# EAGLE design output (EAGLE 9.6.2)
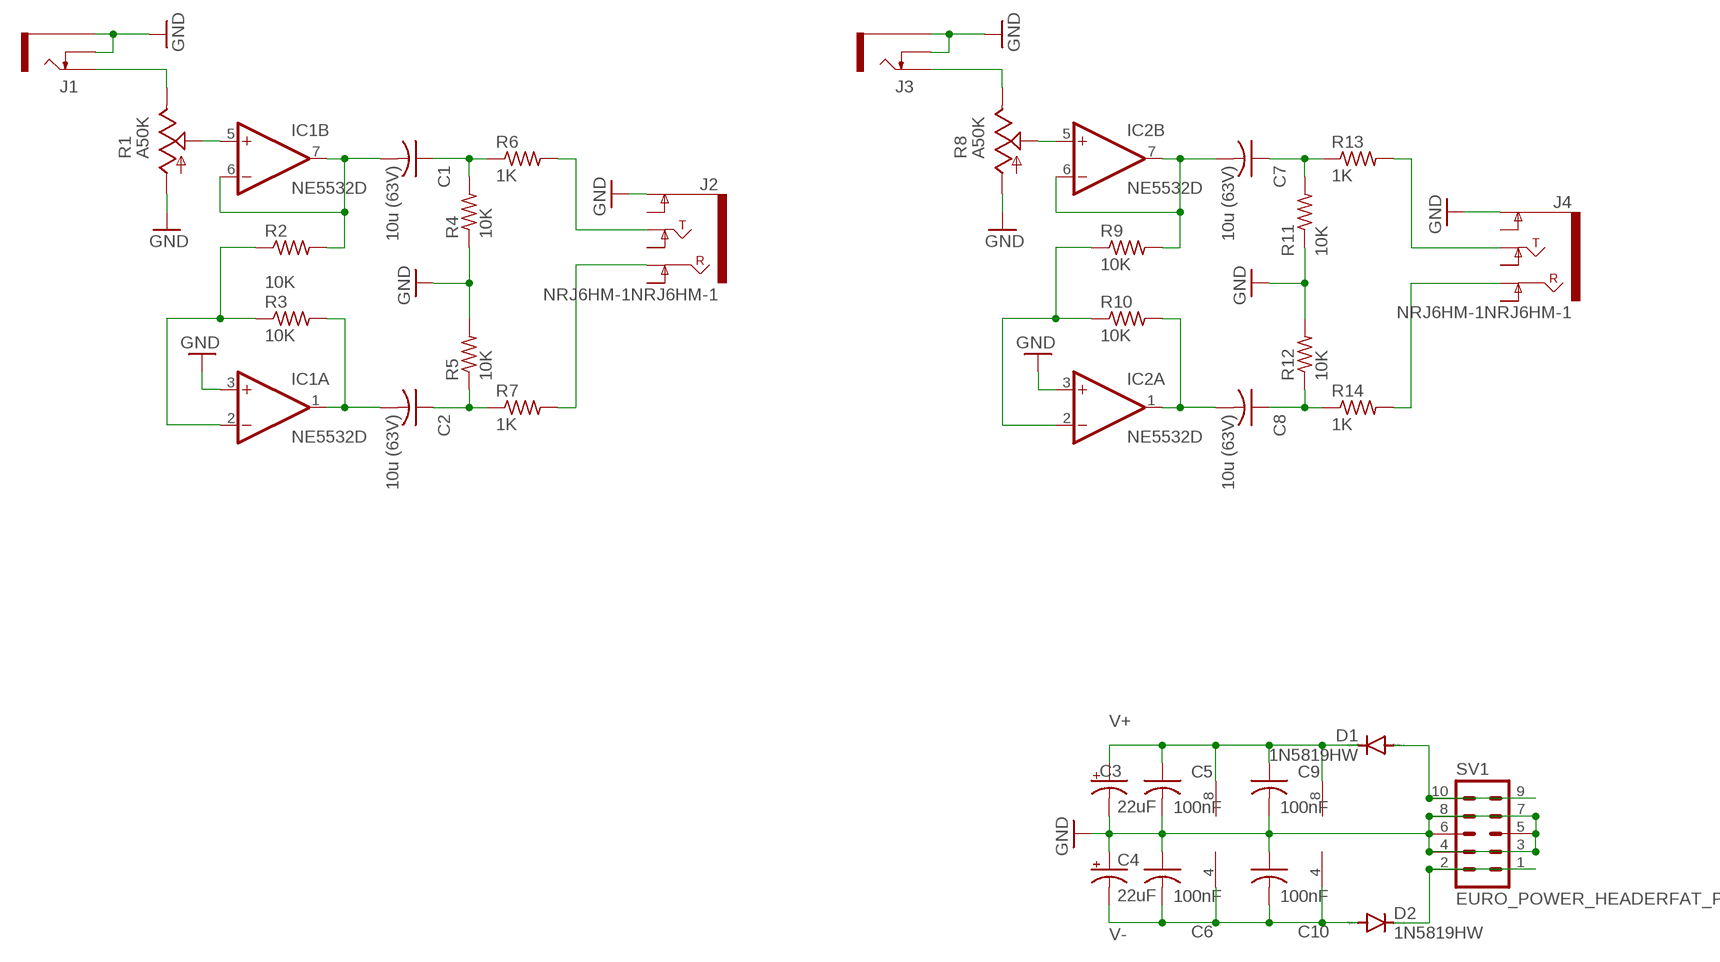
[diagram p0: schematic, sheet 1]

## Parts
C1  10u (63V)  C-USC1210  [C1210]
C2  10u (63V)  C-USC1210  [C1210]
C3  22uF  CPOL-USB  [PANASONIC_B]
C4  22uF  CPOL-USB  [PANASONIC_B]
C5  100nF  C-USC0805  [C0805]
C6  100nF  C-USC0805  [C0805]
C7  10u (63V)  C-USC1210  [C1210]
C8  10u (63V)  C-USC1210  [C1210]
C9  100nF  C-USC0805  [C0805]
C10  100nF  C-USC0805  [C0805]
D1  1N5819HW  DIODE-SOD123  [SOD123]
D2  1N5819HW  DIODE-SOD123  [SOD123]
IC1  NE5532D  [SO08]
IC2  NE5532D  [SO08]
J1  PJ302M  [PJ302M]
J2  NRJ6HM-1NRJ6HM-1  [NRJ6HM-1]
J3  PJ302M  [PJ302M]
J4  NRJ6HM-1NRJ6HM-1  [NRJ6HM-1]
R1  A50K  ALPHA_9MM_POT_RIGHT_ANGLE  [ALPHA_9MM_POT_RIGHT_ANGLE]
R2  10K  R-US_R0805  [R0805]
R3  10K  R-US_R0805  [R0805]
R4  10K  R-US_R0805  [R0805]
R5  10K  R-US_R0805  [R0805]
R6  1K  R-US_R0805  [R0805]
R7  1K  R-US_R0805  [R0805]
R8  A50K  ALPHA_9MM_POT_RIGHT_ANGLE  [ALPHA_9MM_POT_RIGHT_ANGLE]
R9  10K  R-US_R0805  [R0805]
R10  10K  R-US_R0805  [R0805]
R11  10K  R-US_R0805  [R0805]
R12  10K  R-US_R0805  [R0805]
R13  1K  R-US_R0805  [R0805]
R14  1K  R-US_R0805  [R0805]
SV1  EURO_POWER_HEADERFAT_PADS  [EURO_PWR_HEADER_FAT]

## Nets
GND: C3.- C4.+ C5.2 C6.1 C9.2 C10.1 IC1.3(A:+IN) IC2.3(A:+IN) J1.GND(SLEEVE) J1.SW(SWITCH) J2.SLEEVE(EARTH) J3.GND(SLEEVE) J3.SW(SWITCH) J4.SLEEVE(EARTH) R1.1(A) R4.1 R5.2 R8.1(A) R11.1 R12.2 SV1.3 SV1.4 SV1.5 SV1.6 SV1.7 SV1.8
N$1: IC1.2(A:-IN) R2.1 R3.1
N$2: C2.2 IC1.1(A:OUT) R3.2
N$3: C1.2 IC1.6(B:-IN) IC1.7(B:OUT) R2.2
N$4: IC1.5(B:+IN) R1.2(S)
N$5: C1.1 R4.2 R6.1
N$6: IC2.5(B:+IN) R8.2(S)
N$7: C2.1 R5.1 R7.1
N$9: J1.TIP R1.3(E)
N$10: J2.TIP R6.2
N$12: J3.TIP R8.3(E)
N$14: J2.RING R7.2
N$15: D1.A SV1.9 SV1.10
N$17: C7.1 R11.2 R13.1
N$19: C8.1 R12.1 R14.1
N$20: J4.TIP R13.2
N$21: J4.RING R14.2
N$22: IC2.2(A:-IN) R9.1 R10.1
N$23: C8.2 IC2.1(A:OUT) R10.2
N$24: C7.2 IC2.6(B:-IN) IC2.7(B:OUT) R9.2
N$25: D2.C SV1.1 SV1.2
V+: C3.+ C5.1 C9.1 D1.C IC1.8(P:V+) IC2.8(P:V+)
V-: C4.- C6.2 C10.2 D2.A IC1.4(P:V-) IC2.4(P:V-)
Unconnected: J2.RING-NORM J2.SLEEVE-NORM(EARTH-NORM) J2.TIP-NORM J4.RING-NORM J4.SLEEVE-NORM(EARTH-NORM) J4.TIP-NORM

## Library data of the parts
C1 C2 C5-C10 = rcl:C-US: CAPACITOR, American symbol; SPICEPREFIX: C
C3 C4 = rcl:CPOL-US: POLARIZED CAPACITOR, American symbol; SPICEPREFIX: C
D1 D2 = diode:DIODE-: DIODE
IC1 IC2 = linear:NE5532: AUDIO AMPLIFIER
J1 J3 = eurorack:PJ302M: PJ302M horizontal / right angled mount 3.5 mm jack socket
J2 J4 = eurorack:NRJ6HM-1: Neutrik NRJ6HM-1 See: Neutrik NRJ6HM-1 datasheet <https://www.neutrik.com/en/product/nrj6hm-1>
R1 R8 = eurorack:ALPHA_9MM_POT_RIGHT_ANGLE: Alpha 9mm right angle / horizontal potentiometer See: Thonk Alpha 9mm Pots – Right-Angle T18 Shaft <https://www.thonk.co.uk/shop/alpha-right-angle-t18/>
R2-R7 R9-R14 = rcl:R-US_: RESISTOR, American symbol; SPICEPREFIX: R
SV1 = MusicThingModular:EURO_POWER_HEADER: Power Header 10 pin power header for Eurorack Power Supplies Variants with fatter pads for easier soldering, and the LOCK variant which has 5mil offset pins to hold the component in place before soldering

## Board
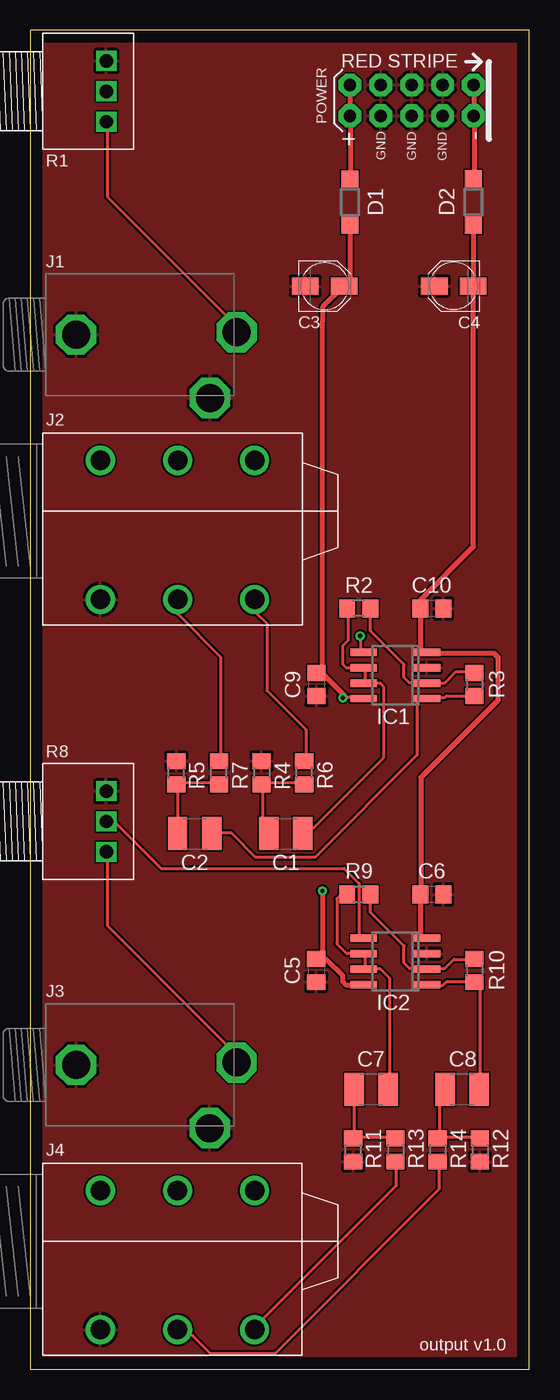
[diagram p1: board, top side]
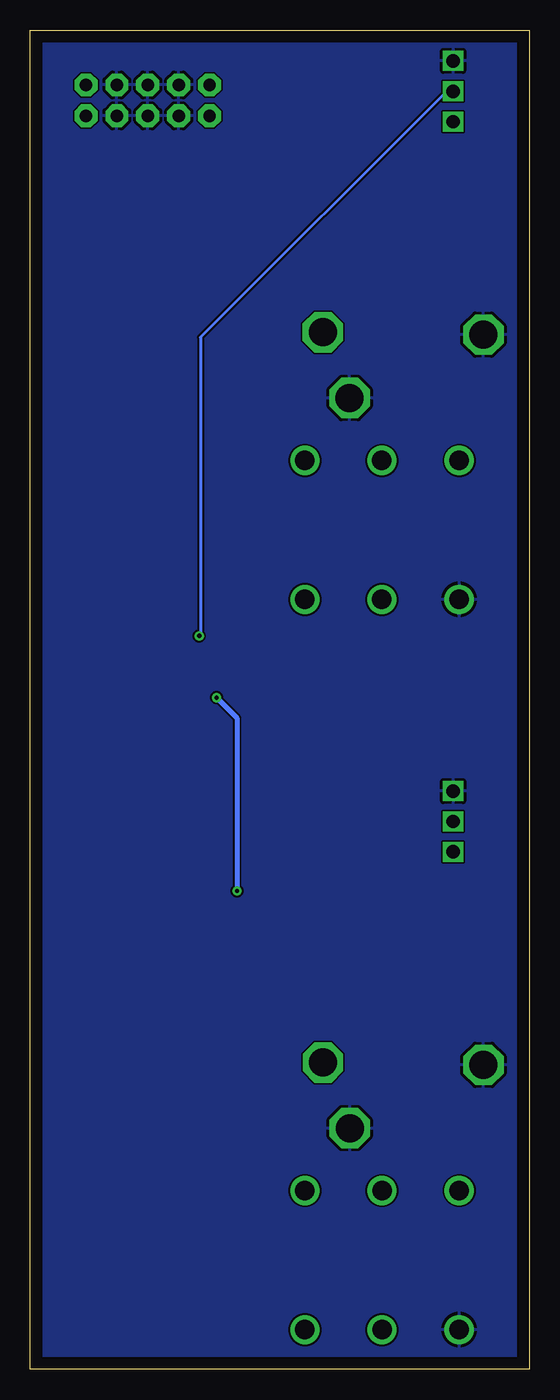
[diagram p2: board, bottom side, seen from below]

Size 41 x 110 mm. Coordinates in mm from the lower left corner, seen from the top.
Outline: 0,0 41,0 41,110 0,110 0,0
Copper layers (1*16): Top 0.035mm / dielectric 1.5mm / Bottom 0.035mm
Design rules "default": minimum track width 6mil, minimum drill 0.35mm, track to track 6mil, track to pad 6mil, pad to pad 6mil, via to via 6mil, smd to smd 6mil, copper to edge 40mil, drill to drill 6mil, minimum pad ring 10mil, minimum via ring 8mil, stop-mask expansion 4mil, vias tented up to drill 0mil, thermal gap 10mil

### Footprints (pad centres in the part's own frame; a part is rotated, then mirrored left to right if it is on the bottom)
C1210 = smd 1.6 x 2.7: 1 -1.4,0; 2 1.4,0
PANASONIC_B = smd 2.2 x 1.4: + 1.6,0; - -1.6,0
C0805 = smd 1.3 x 1.5: 1 -0.95,0; 2 0.95,0
SOD123 = smd 1.4 x 1.4: A 1.9,0; C -1.9,0
SO08 = smd 0.6 x 2.2: 1 -1.905,-2.6; 2 -0.635,-2.6; 3 0.635,-2.6; 4 1.905,-2.6; 5 1.905,2.6; 6 0.635,2.6; 7 -0.635,2.6; 8 -1.905,2.6
PJ302M = drill 2.3 pad 3.3 octagon: GND 2.5,0; SW 13.5,-5.2; TIP 15.7,0.2
NRJ6HM-1 = drill 1.6: RING 11.1,-7.26; RING-NORM 11.1,4.17; SLEEVE 4.75,-7.26; SLEEVE-NORM 4.75,4.17; TIP 17.43,-7.26; TIP-NORM 17.43,4.17
ALPHA_9MM_POT_RIGHT_ANGLE = drill 1.1 square: 1 -2.5,0; 2 0,0; 3 2.5,0
R0805 = smd 1.3 x 1.5: 1 -0.95,0; 2 0.95,0
EURO_PWR_HEADER_FAT = drill 1.016 pad 1.88 octagon: 1 -5.08,-1.27; 2 -5.08,1.27; 3 -2.54,-1.27; 4 -2.54,1.27; 5 0,-1.27; 6 0,1.27; 7 2.54,-1.27; 8 2.54,1.27; 9 5.08,-1.27; 10 5.08,1.27

### Placement (x,y rotation side)
C1  21,44 0 top
C2  13.5,44 0 top
C3  24.2,89 0 top
C4  34.8,89 180 top
C5  23.5,32.75 270 top
C6  33,39 180 top
C7  28,23 0 top
C8  35.48,23 0 top
C9  23.52,56.25 270 top
C10  33,62.5 180 top
D1  26.27,95.89 90 top
D2  36.42,95.9 270 top
IC1  30,57 90 top
IC2  30,33.5 90 top
J1  1.25,85 0 top
J2  1,70.5 0 top
J3  1.25,25 0 top
J4  1,10.5 0 top
R1  6.25,105 270 top
R2  27,62.5 180 top
R3  36.5,56.25 270 top
R4  19.01,49 270 top
R5  12.01,49 90 top
R6  22.51,49 90 top
R7  15.51,49 90 top
R8  6.25,45 270 top
R9  27,39 180 top
R10  36.5,32.75 270 top
R11  26.54,18 90 top
R12  36.95,18 270 top
R13  30.01,18 270 top
R14  33.48,18 270 top
SV1  31.35,104.25 180 top

### Tracks (layer width: path | path; a pad name or v marks a point on that pad's centre or on a via)
GND
  pour Top: 41.76,110.6 0,110.6 -0.04,110.56 -0.04,-1.27 41.76,-1.27
  pour Bottom: 41.45,110.33 0.43,110.33 0.43,-0.7 41.45,-0.7
N$1
  Top 0.254: R2.1 27.98,62.48 27.98,60.66 30.72,57.91 30.72,56.84 31.18,56.39 32.55,56.39 IC1.2 32.7,56.39 34.07,56.39 34.98,57.3 36.36,57.3 R3.1
N$2
  Top 0.254: R3.2 36.36,55.32 34.22,55.32 34.07,55.17 32.7,55.17 IC1.1 32.55,55.02 31.94,55.02 31.79,54.86 31.79,50.44 23.4,42.06 18.53,42.06 16.55,44.04 15.02,44.04 C2.2
N$3
  Top 0.254: R2.2 26.15,62.48 26.15,59.89 25.69,59.44 25.69,57.91 25.99,57.61 27.36,57.61 IC1.6 27.52,57.61 27.52,56.39 | C1.2 22.82,44 29.04,50.23 29.04,56.08 28.74,56.39 27.52,56.39 | 27.52,56.39 IC1.7
N$4  (via drill 0.35)
  Top 0.254: IC1.5 27.12,59.19 v27.12,60.25
  Bottom 0.254: v27.12,60.25 27.02,60.35 27.02,84.78 6.94,104.85 6.33,104.85 R1.2
N$5
  Top 0.254: R6.1 22.49,48.16 19.14,48.16 R4.2 19.14,48.01 19.14,44.5 19.59,44.04 C1.1
N$6
  Top 0.254: IC2.5 27.02,35.79 27.02,37.89 27.01,37.9 27.01,39.93 25.78,41.16 10.74,41.16 6.94,44.96 6.33,44.96 R8.2
N$7
  Top 0.254: R7.1 15.48,48.16 12.12,48.16 R5.1 12.12,48.01 12.12,44.04 C2.1
N$9
  Top 0.254: R1.3 6.33,102.41 6.33,96.32 16.85,85.8 16.85,85.34 J1.TIP
N$10
  Top 0.254: R6.2 22.64,49.99 22.64,52.55 19.44,55.75 19.44,61.27 18.53,62.18 18.53,63.14 J2.TIP
N$12
  Top 0.254: R8.3 6.33,42.37 6.33,36.42 16.85,25.91 16.85,25.3 J3.TIP
N$14
  Top 0.254: R7.2 15.63,49.99 15.63,58.52 12.12,62.03 12.12,63.14 J2.RING
N$15
  Top 0.406: D1.A 26.3,97.84 26.3,102.87 SV1.10 26.3,103.02 26.3,105.46 SV1.9
N$17
  Top 0.254: 26.6,19.05 29.96,19.05 R13.1 | 26.6,19.05 26.6,22.86 C7.1 | 26.6,19.05 R11.2
N$19
  Top 0.254: 33.61,19.05 36.81,19.05 R12.1 | 33.61,19.05 33.61,22.4 34.07,22.86 C8.1 | 33.61,19.05 R14.1
N$20
  Top 0.254: R13.2 30.11,16.92 30.11,15.09 18.53,3.5 18.53,3.24 J4.TIP
N$21
  Top 0.254: R14.2 33.61,16.92 33.61,14.79 20.14,1.32 14.77,1.32 13.34,2.74 12.5,2.84 J4.RING
N$22
  Top 0.254: R9.1 27.98,38.86 27.98,37.53 30.72,34.79 30.72,33.38 31.18,32.92 32.55,32.92 IC2.2 32.7,32.92 34.07,32.92 34.83,33.68 36.36,33.68 R10.1
N$23
  Top 0.254: IC2.1 32.7,31.55 33.92,31.55 34.22,31.85 36.36,31.85 R10.2 36.51,31.7 36.97,31.24 36.97,23.01 C8.2
N$24
  Top 0.254: R9.2 25.55,39 25.19,38.64 25.19,34.94 25.99,34.14 27.36,34.14 IC2.6 27.52,33.98 27.52,32.92 | 27.52,32.92 28.74,32.92 29.5,32.16 29.5,23.01 C7.2 | 27.52,32.92 IC2.7
N$25
  Top 0.406: D2.C 36.51,97.84 36.51,102.87 SV1.2 36.51,103.02 36.51,105.46 SV1.1
V+  (via drill 0.35)
  Top 0.152: 26.27,89.47 C3.+ | 24.01,86.3 24.01,86.1
  Top 0.254: 24.32,33.68 24.01,33.68 | 24.01,33.68 23.55,33.68 C5.1 24.01,33.68 | 27.36,31.55 IC2.8 | IC1.8 27.36,55.17 25.99,55.17 25.84,55.32 v25.69,55.17 | 24.01,57.15 23.55,57.15 C9.1 24.01,57.15
  Top 0.406: 24.32,33.68 25.69,32.31 25.69,31.85 25.99,31.55 27.36,31.55 | 25.84,55.32 24.01,57.15 24.01,86.1 | 26.3,93.88 D1.C 26.27,89.47 | 24.01,86.3 24.01,87.24 25.77,89 C3.+ | v24.01,39.3 24.01,33.68
  Bottom 0.406: v24.01,39.3 24.01,53.49 v25.69,55.17
V-
  Top 0.152: 36.42,88.98 C4.-
  Top 0.254: 32.09,35.66 32.24,35.51 32.55,35.51 IC2.4 | 32.09,38.86 C6.2 32.09,39.01 | 32.09,59.13 32.24,58.98 32.55,58.98 IC1.4 32.7,58.83 | 32.09,62.48 C10.2 32.09,62.64 32.09,63.25
  Top 0.406: 32.09,35.66 32.09,38.86 | 32.09,59.13 32.09,62.48 | 32.09,39.01 32.09,48.62 38.43,54.96 38.43,58.51 38.12,58.83 32.7,58.83 | 32.09,63.25 36.42,67.58 36.42,88.98 36.42,93.73 D2.A 36.52,93.9

### Text on the board
tNames: output v1.0